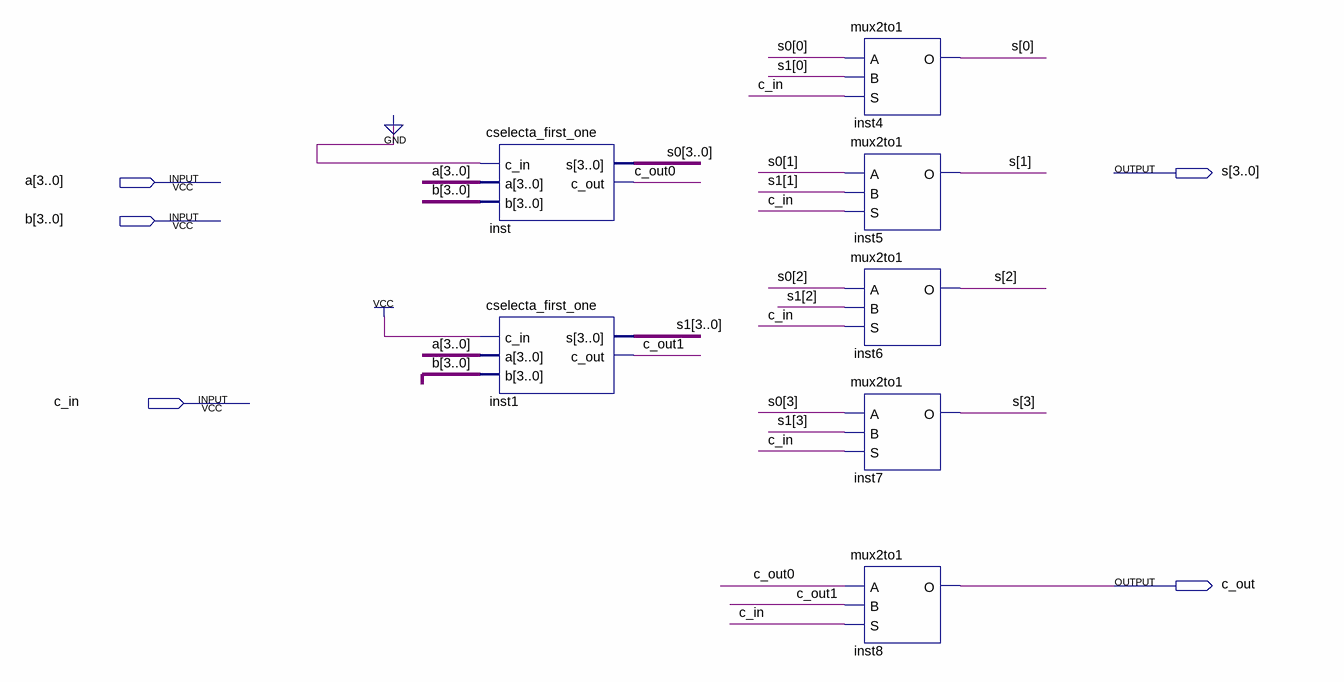
[diagram p0: schematic sheet]
// Quartus schematic cselecta_second_one.bdf as structural Verilog: 7 symbols, 5 pins
module cselecta_second_one (
  input  [3:0] a,
  input  [3:0] b,
  input  c_in,
  output [3:0] s,
  output c_out
);

  wire c_out0, c_out1;
  wire [3:0] s0, s1;

  cselecta_first_one inst (.c_in(1'b0), .a(a), .b(b), .s(s0), .c_out(c_out0));
  cselecta_first_one inst1 (.c_in(1'b1), .a(a), .b(b), .s(s1), .c_out(c_out1));
  mux2to1 inst4 (.A(s0[0]), .B(s1[0]), .S(c_in), .O(s[0]));
  mux2to1 inst5 (.A(s0[1]), .B(s1[1]), .S(c_in), .O(s[1]));
  mux2to1 inst6 (.A(s0[2]), .B(s1[2]), .S(c_in), .O(s[2]));
  mux2to1 inst7 (.A(s0[3]), .B(s1[3]), .S(c_in), .O(s[3]));
  mux2to1 inst8 (.A(c_out0), .B(c_out1), .S(c_in), .O(c_out));
endmodule
